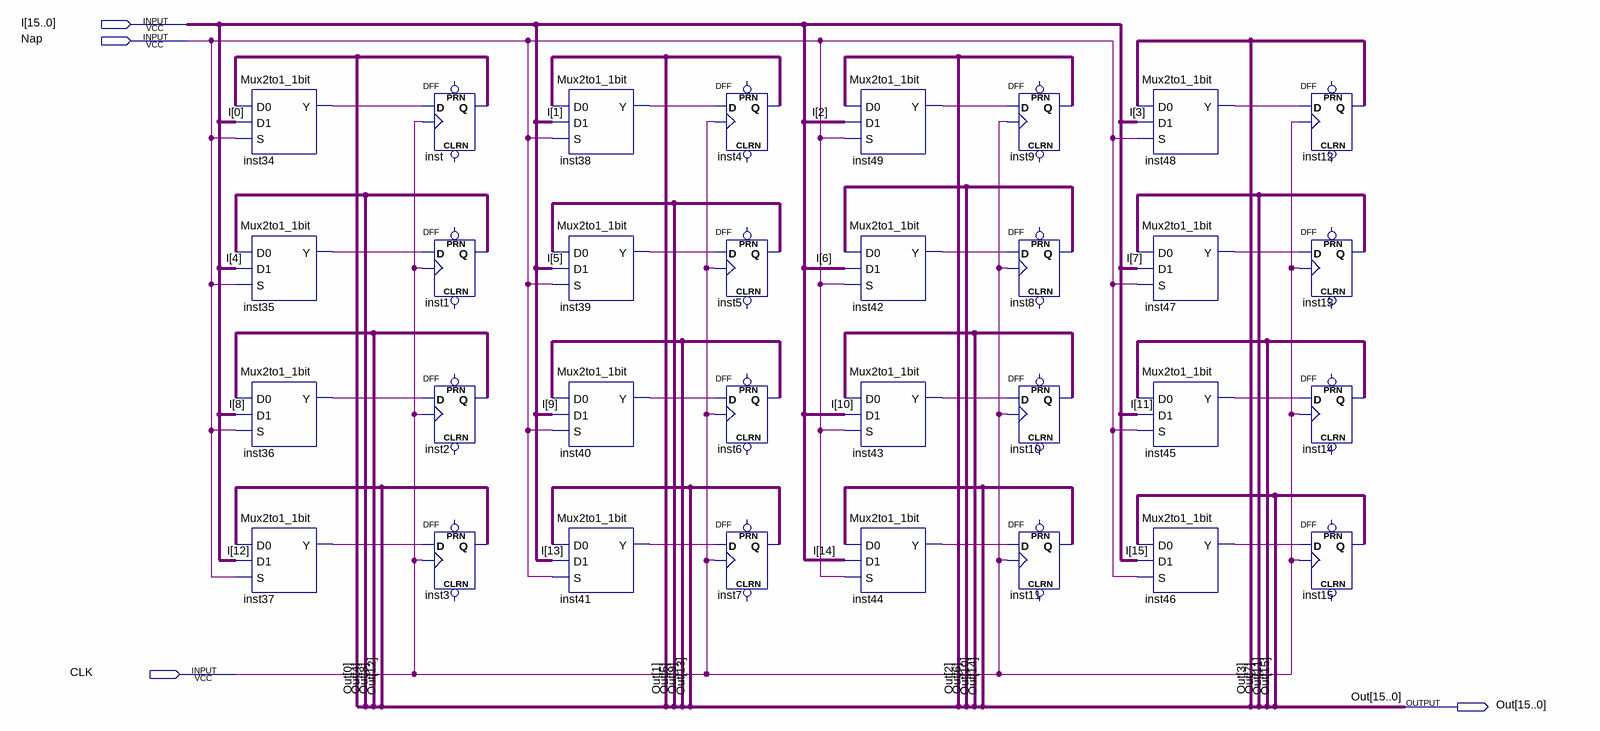
[diagram p0: schematic sheet]
// Quartus schematic register16bit.bdf as structural Verilog: 32 symbols, 4 pins
module register16bit (
  input  [15:0] I,
  input  Nap,
  input  CLK,
  output [15:0] Out
);

  wire inst34_y, inst35_y, inst36_y, inst37_y, inst38_y, inst39_y, inst40_y, inst41_y, inst42_y, inst43_y,
       inst44_y, inst45_y, inst46_y, inst47_y, inst48_y, inst49_y;

  Mux2to1_1bit inst34 (.D0(Out[0]), .D1(I[0]), .S(Nap), .Y(inst34_y));
  Mux2to1_1bit inst35 (.D0(Out[4]), .D1(I[4]), .S(Nap), .Y(inst35_y));
  Mux2to1_1bit inst36 (.D0(Out[8]), .D1(I[8]), .S(Nap), .Y(inst36_y));
  Mux2to1_1bit inst37 (.D0(Out[12]), .D1(I[12]), .S(Nap), .Y(inst37_y));
  DFF inst (.CLK(CLK), .D(inst34_y), .Q(Out[0]));  // open: CLRN, PRN
  DFF inst1 (.CLK(CLK), .D(inst35_y), .Q(Out[4]));  // open: CLRN, PRN
  DFF inst2 (.CLK(CLK), .D(inst36_y), .Q(Out[8]));  // open: CLRN, PRN
  DFF inst3 (.CLK(CLK), .D(inst37_y), .Q(Out[12]));  // open: CLRN, PRN
  Mux2to1_1bit inst38 (.D0(Out[1]), .D1(I[1]), .S(Nap), .Y(inst38_y));
  Mux2to1_1bit inst39 (.D0(Out[5]), .D1(I[5]), .S(Nap), .Y(inst39_y));
  Mux2to1_1bit inst40 (.D0(Out[9]), .D1(I[9]), .S(Nap), .Y(inst40_y));
  Mux2to1_1bit inst41 (.D0(Out[13]), .D1(I[13]), .S(Nap), .Y(inst41_y));
  DFF inst4 (.CLK(CLK), .D(inst38_y), .Q(Out[1]));  // open: CLRN, PRN
  DFF inst5 (.CLK(CLK), .D(inst39_y), .Q(Out[5]));  // open: CLRN, PRN
  DFF inst6 (.CLK(CLK), .D(inst40_y), .Q(Out[9]));  // open: CLRN, PRN
  DFF inst7 (.CLK(CLK), .D(inst41_y), .Q(Out[13]));  // open: CLRN, PRN
  Mux2to1_1bit inst49 (.D0(Out[2]), .D1(I[2]), .S(Nap), .Y(inst49_y));
  Mux2to1_1bit inst42 (.D0(Out[6]), .D1(I[6]), .S(Nap), .Y(inst42_y));
  Mux2to1_1bit inst43 (.D0(Out[10]), .D1(I[10]), .S(Nap), .Y(inst43_y));
  Mux2to1_1bit inst44 (.D0(Out[14]), .D1(I[14]), .S(Nap), .Y(inst44_y));
  DFF inst9 (.CLK(CLK), .D(inst49_y), .Q(Out[2]));  // open: CLRN, PRN
  DFF inst8 (.CLK(CLK), .D(inst42_y), .Q(Out[6]));  // open: CLRN, PRN
  DFF inst10 (.CLK(CLK), .D(inst43_y), .Q(Out[10]));  // open: CLRN, PRN
  DFF inst11 (.CLK(CLK), .D(inst44_y), .Q(Out[14]));  // open: CLRN, PRN
  Mux2to1_1bit inst48 (.D0(Out[3]), .D1(I[3]), .S(Nap), .Y(inst48_y));
  Mux2to1_1bit inst47 (.D0(Out[7]), .D1(I[7]), .S(Nap), .Y(inst47_y));
  Mux2to1_1bit inst45 (.D0(Out[11]), .D1(I[11]), .S(Nap), .Y(inst45_y));
  Mux2to1_1bit inst46 (.D0(Out[15]), .D1(I[15]), .S(Nap), .Y(inst46_y));
  DFF inst12 (.CLK(CLK), .D(inst48_y), .Q(Out[3]));  // open: CLRN, PRN
  DFF inst13 (.CLK(CLK), .D(inst47_y), .Q(Out[7]));  // open: CLRN, PRN
  DFF inst14 (.CLK(CLK), .D(inst45_y), .Q(Out[11]));  // open: CLRN, PRN
  DFF inst15 (.CLK(CLK), .D(inst46_y), .Q(Out[15]));  // open: CLRN, PRN
endmodule
